# Altium schematic sheet POT 2x8.SchDoc
size C
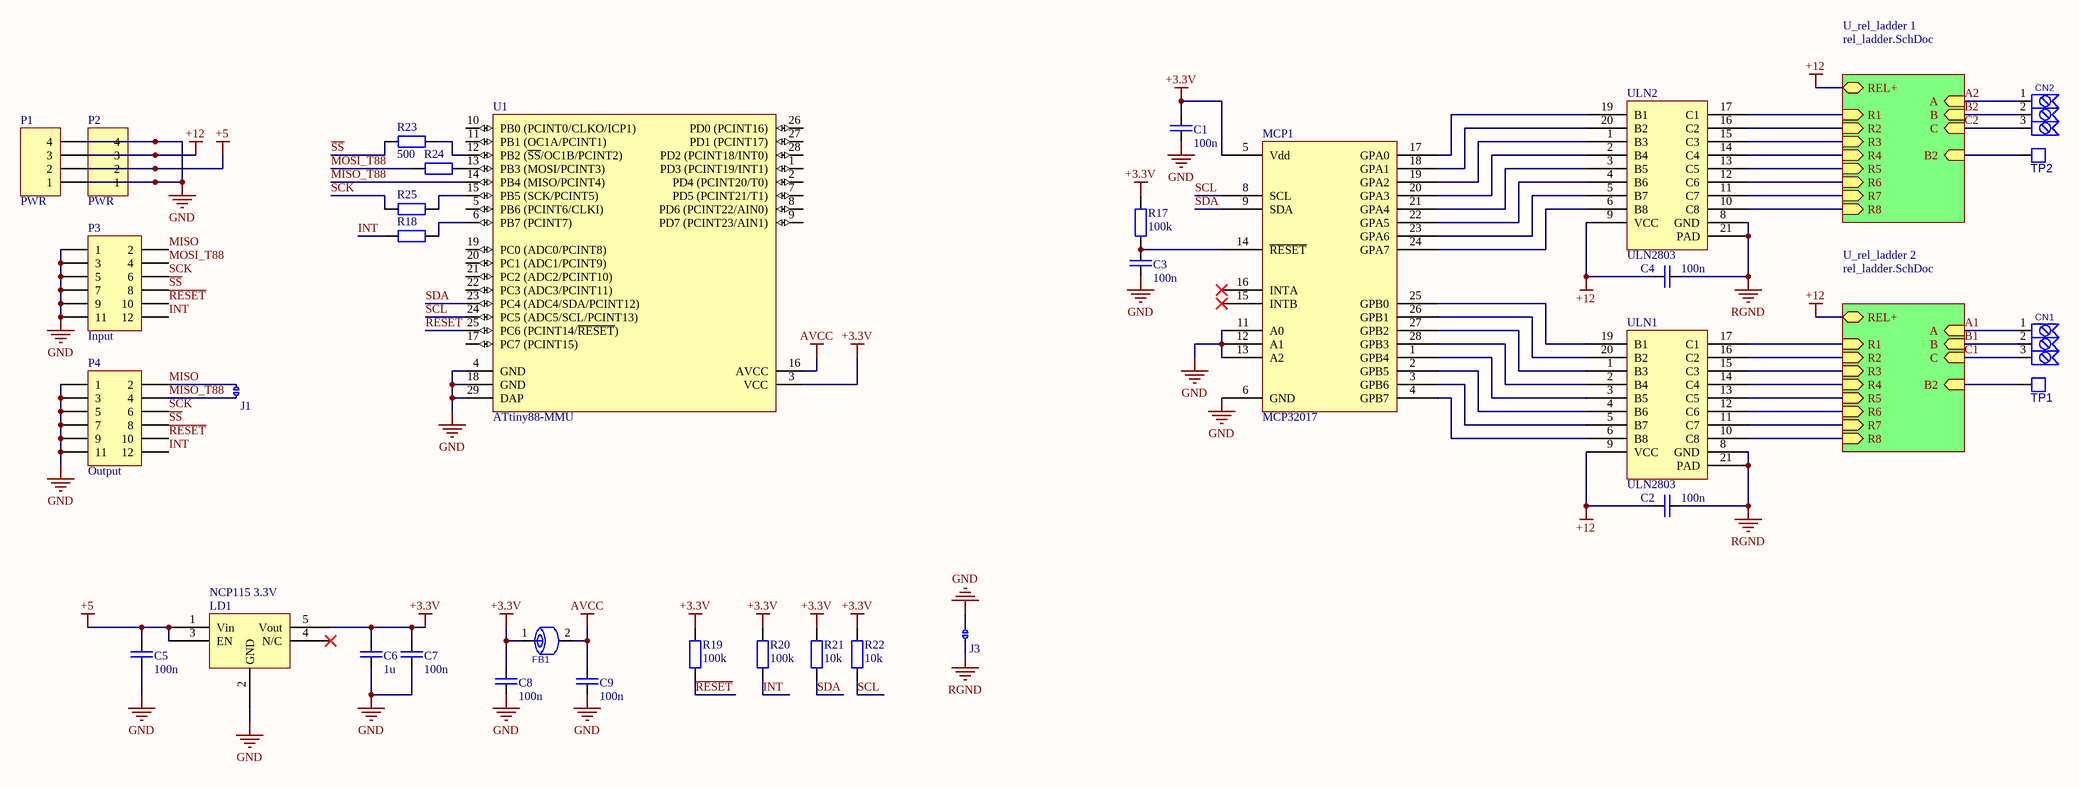
[diagram p0: POT 2x8.SchDoc]

## Parts
C1  100n  [R1005_0402i_L]
C2  100n  [R1005_0402i_L]
C3  100n  [R1005_0402i_L]
C4  100n  [R1005_0402i_L]
C5  100n  [R1005_0402i_L]
C6  1u  [C1608_0603I_L]
C7  100n  [R1005_0402i_L]
C8  100n  [R1005_0402i_L]
C9  100n  [R1005_0402i_L]
CN1  VRSTNA SPONKA 3P/16A  [VRSTNA SPONKA 3P/16A]  (value not drawn)
CN2  VRSTNA SPONKA 3P/16A  [VRSTNA SPONKA 3P/16A]  (value not drawn)
FB1  FERITTE BEAD  [R1608_0603I_L]  (value not drawn)
J1  Terminator  [solderJumper]  (value not drawn)
J3  JMP_mini  [solderJumper]  (value not drawn)
LD1  NCP115 3.3V  [TSOP95P280X110-6L]
MCP1  MCP32017  [MCP23017 QFN]
P1  PWR  [HDR1X4]
P2  PWR  [HDR1X4]
P3  Input  [1.27mm SMD conn]
P4  Output  [1.27mm SMD conn]
R17  100k  [R1005_0402i_L]
R18  500  [R1005_0402i_L]  (value not drawn)
R19  100k  [R1005_0402i_L]
R20  100k  [R1005_0402i_L]
R21  10k  [R1005_0402i_L]
R22  10k  [R1005_0402i_L]
R23  500  [R1005_0402i_L]
R24  500  [R1005_0402i_L]  (value not drawn)
R25  500  [R1005_0402i_L]  (value not drawn)
TP1  PAD  [PAD_CIRC_HOLE]  (value not drawn)
TP2  PAD  [PAD_CIRC_HOLE]  (value not drawn)
U1  ATtiny88-MMU  [28M1_N]
ULN1  ULN2803  [QFN127P600-8N]
ULN2  ULN2803  [QFN127P600-8N]

## Sub-sheets
U_rel_ladder 1 = rel_ladder.SchDoc: B (in), C (in), A (in), REL+ (bidir), R1 (in), R2 (in), R3 (in), R4 (in), R5 (in), R6 (in), R7 (in), R8 (in), B2 (in)
U_rel_ladder 2 = rel_ladder.SchDoc: B (in), C (in), A (in), REL+ (bidir), R1 (in), R2 (in), R3 (in), R4 (in), R5 (in), R6 (in), R7 (in), R8 (in), B2 (in)

## Nets
+3.3V: C1.2 C6.1 C7.1 C8.1 FB1.1 LD1.5(Vout) MCP1.5(Vdd) R17.1 R19.1 R20.1 R21.1 R22.1 U1.3(VCC)
+5: C5.1 LD1.1(Vin) LD1.3(EN) P1.2 P2.2
+12: C2.1 C4.1 P1.3 P2.3 ULN1.9(VCC) ULN2.9(VCC) ; sheet U_rel_ladder 1/REL+, sheet U_rel_ladder 2/REL+
AVCC: C9.1 FB1.2 U1.16(AVCC)
GND: C1.1 C3.1 C5.2 C6.2 C7.2 C8.2 C9.2 J3.2 LD1.2(GND) MCP1.6(GND) MCP1.11(A0) MCP1.12(A1) MCP1.13(A2) P1.1 P1.4 P2.1 P2.4 P3.1 P3.3 P3.5 P3.7 P3.9 P3.11 P4.1 P4.3 P4.5 P4.7 P4.9 P4.11 U1.4(GND) U1.18(GND) U1.29(DAP)
RGND: C2.2 C4.2 J3.1 ULN1.8(GND) ULN1.21(PAD) ULN2.8(GND) ULN2.21(PAD)
A1: CN1.1 ; sheet U_rel_ladder 2/A
A2: CN2.1 ; sheet U_rel_ladder 1/A
B1: CN1.2 ; sheet U_rel_ladder 2/B
B2: CN2.2 ; sheet U_rel_ladder 1/B
C1: CN1.3 ; sheet U_rel_ladder 2/C
C2: CN2.3 ; sheet U_rel_ladder 1/C
INT: P3.12 P4.12 R18.1 R20.2
MISO: J1.2 P3.2 P4.2
MISO_T88: J1.1 P4.4 U1.14(PB4_(MISO/PCINT4))
MOSI_T88: P3.4 R24.1
~{RESET}: P3.10 P4.10 R19.2 U1.25(PC6_(PCINT14/~{RESET}))
~{SS}: P3.8 P4.8 R23.1
SCK: P3.6 P4.6 R25.1
SCL: MCP1.8(SCL) R22.2 U1.24(PC5_(ADC5/SCL/PCINT13))
SDA: MCP1.9(SDA) R21.2 U1.23(PC4_(ADC4/SDA/PCINT12))
NetC3_2: C3.2 MCP1.14(~{RESET}) R17.2
NetMCP1_1: MCP1.1(GPB4) ULN1.3(B5)
NetMCP1_2: MCP1.2(GPB5) ULN1.4(B6)
NetMCP1_3: MCP1.3(GPB6) ULN1.5(B7)
NetMCP1_4: MCP1.4(GPB7) ULN1.6(B8)
NetMCP1_17: MCP1.17(GPA0) ULN2.19(B1)
NetMCP1_18: MCP1.18(GPA1) ULN2.20(B2)
NetMCP1_19: MCP1.19(GPA2) ULN2.1(B3)
NetMCP1_20: MCP1.20(GPA3) ULN2.2(B4)
NetMCP1_21: MCP1.21(GPA4) ULN2.3(B5)
NetMCP1_22: MCP1.22(GPA5) ULN2.4(B6)
NetMCP1_23: MCP1.23(GPA6) ULN2.5(B7)
NetMCP1_24: MCP1.24(GPA7) ULN2.6(B8)
NetMCP1_25: MCP1.25(GPB0) ULN1.19(B1)
NetMCP1_26: MCP1.26(GPB1) ULN1.20(B2)
NetMCP1_27: MCP1.27(GPB2) ULN1.1(B3)
NetMCP1_28: MCP1.28(GPB3) ULN1.2(B4)
NetR18_2: R18.2 U1.6(PB7_(PCINT7))
NetR23_2: R23.2 U1.12(PB2_(~{SS}/OC1B/PCINT2))
NetR24_2: R24.2 U1.13(PB3_(MOSI/PCINT3))
NetR25_2: R25.2 U1.15(PB5_(SCK/PCINT5))
NetTP1_1: TP1.1 ; sheet U_rel_ladder 2/B2
NetTP2_1: TP2.1 ; sheet U_rel_ladder 1/B2
NetULN1_10: ULN1.10(C8) ; sheet U_rel_ladder 2/R8
NetULN1_11: ULN1.11(C7) ; sheet U_rel_ladder 2/R7
NetULN1_12: ULN1.12(C6) ; sheet U_rel_ladder 2/R6
NetULN1_13: ULN1.13(C5) ; sheet U_rel_ladder 2/R5
NetULN1_14: ULN1.14(C4) ; sheet U_rel_ladder 2/R4
NetULN1_15: ULN1.15(C3) ; sheet U_rel_ladder 2/R3
NetULN1_16: ULN1.16(C2) ; sheet U_rel_ladder 2/R2
NetULN1_17: ULN1.17(C1) ; sheet U_rel_ladder 2/R1
NetULN2_10: ULN2.10(C8) ; sheet U_rel_ladder 1/R8
NetULN2_11: ULN2.11(C7) ; sheet U_rel_ladder 1/R7
NetULN2_12: ULN2.12(C6) ; sheet U_rel_ladder 1/R6
NetULN2_13: ULN2.13(C5) ; sheet U_rel_ladder 1/R5
NetULN2_14: ULN2.14(C4) ; sheet U_rel_ladder 1/R4
NetULN2_15: ULN2.15(C3) ; sheet U_rel_ladder 1/R3
NetULN2_16: ULN2.16(C2) ; sheet U_rel_ladder 1/R2
NetULN2_17: ULN2.17(C1) ; sheet U_rel_ladder 1/R1

Not connected (* = marked no-connect by the designer): LD1 4(N/C)*; MCP1 15(INTB)* 16(INTA)*; U1 1(PD3_(PCINT19/INT1)) 2(PD4_(PCINT20/T0)) 5(PB6_(PCINT6/CLKI)) 7(PD5_(PCINT21/T1)) 8(PD6_(PCINT22/AIN0)) 9(PD7_(PCINT23/AIN1)) 10(PB0_(PCINT0/CLKO/ICP1)) 11(PB1_(OC1A/PCINT1)) 17(PC7_(PCINT15)) 19(PC0_(ADC0/PCINT8)) 20(PC1_(ADC1/PCINT9)) 21(PC2_(ADC2/PCINT10)) 22(PC3_(ADC3/PCINT11)) 26(PD0_(PCINT16)) 27(PD1_(PCINT17)) 28(PD2_(PCINT18/INT0))

## Notes on the sheet
- Title
- Size:
- Date:
- File:
- C
- Number:
- Time:
- Revision:
- Sheet
- of

## Library data of the parts
C1-C9 = C: Capacitor
J1 = JMP_mini
P1 P2 = Header 4: Header, 4-Pin; LatestRevisionDate: 17-Jul-2002; LatestRevisionNote: Re-released for DXP Platform.; Publisher: Altium Limited
P3 P4 = Header 6X2: Header, 6-Pin, Dual row; LatestRevisionDate: 17-Jul-2002; LatestRevisionNote: Re-released for DXP Platform.; Publisher: Altium Limited
R17-R25 = R
U1 = ATtiny88-MMU: 8-bit AVR Microcontroller, 1.8-5.5V, 8KB Flash, 64 Bytes EEPROM, 512 Bytes SRAM, 28-pin MLF, Industrial Grade (-40°C to 85°C), Pb-Free; Published: 1-Apr-2010; DatasheetVersion: revC, Mar-2009; PackageVersion: revB, Nov-2008; PackageReference: 28M1; Publisher: Altium Limited; PackageDescription: 28-pad, 4x4x1.0mm Body, Pitch 0.45mm, 2.4x2.4mm Exposed Pad, Plastic Very Thin QFN Package (VQFN); Supplier 1: Digi-Key; Supplier Part Number 1: ATTINY88-MMU-ND; Supplier 2: Mouser; Supplier Part Number 2: 556-ATTINY88-MMU; ComponentLink1Description: Manufacturer Link; ComponentLink1URL: http://www.atmel.com/products/avr/default.asp?; ComponentLink2Description: ATtiny48/88 Datasheet; ComponentLink2URL: http://www.atmel.com/dyn/resources/prod_documents/doc8008.pdf; ComponentLink3Description: ATtiny48/88 Summary; ComponentLink3URL: http://www.atmel.com/dyn/resources/prod_documents/8008S.pdf; ComponentLink4Description: Atmel.com Home; ComponentLink4URL: http://www.atmel.com
CN1 CN2 = VRSTNA SPONKA 3P/16A: Value: *